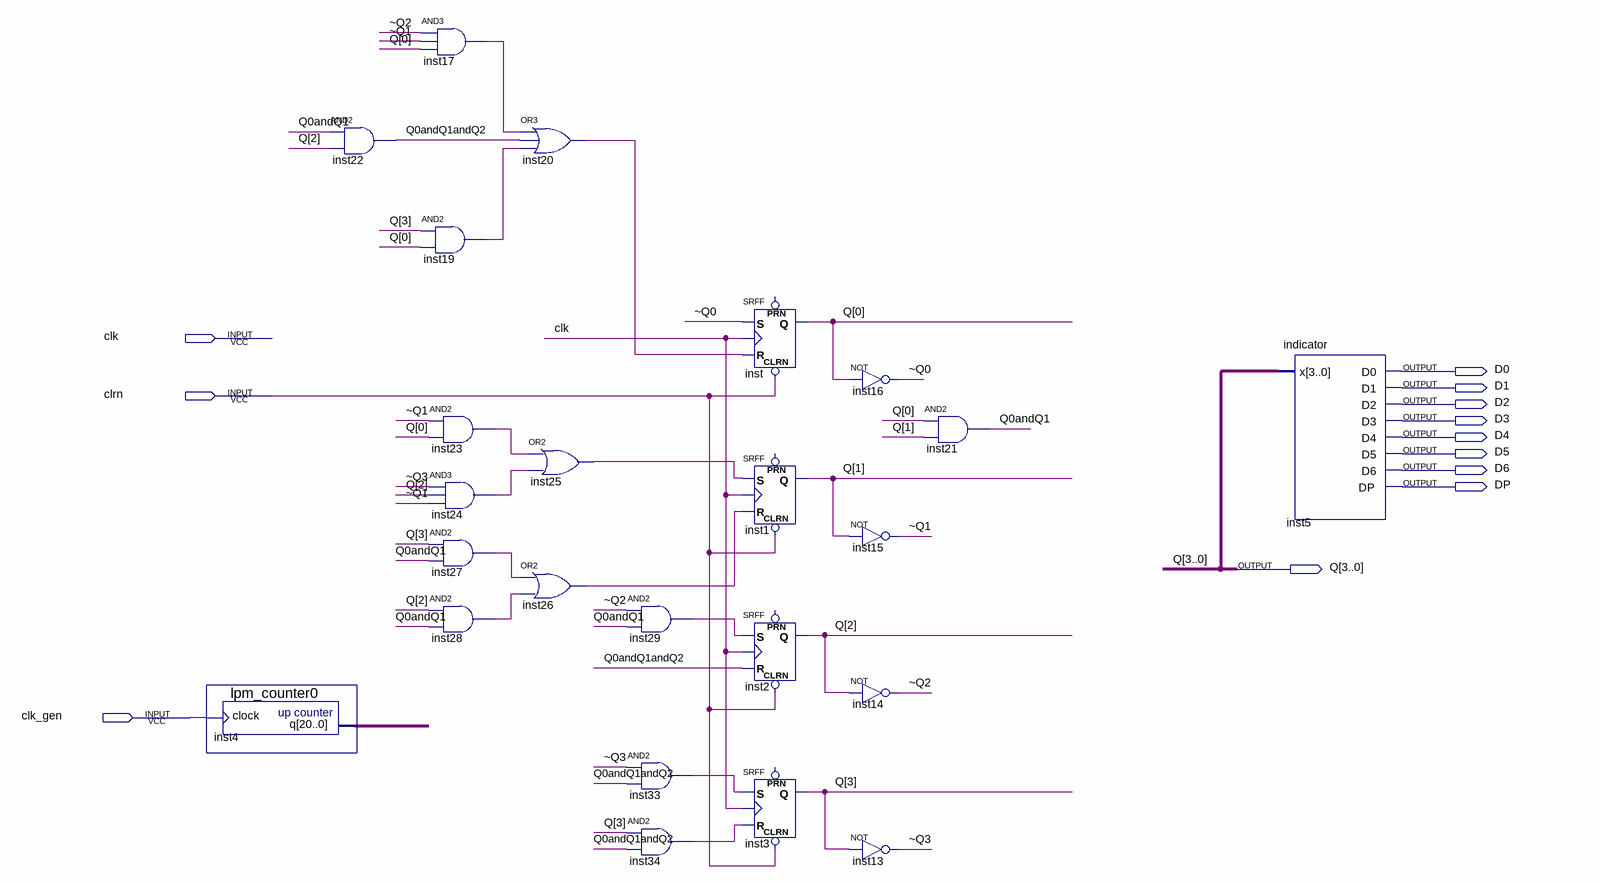
[diagram p0: schematic sheet]
// Quartus schematic lab7p2.bdf as structural Verilog: 24 symbols, 12 pins
module lab7p2 (
  input  clk,
  input  clrn,
  input  clk_gen,
  output D0,
  output D1,
  output D2,
  output D3,
  output D4,
  output D5,
  output D6,
  output DP,
  output [3:0] Q
);

  wire inst17_out, inst19_out, inst20_out, inst23_out, inst24_out, inst25_out, inst26_out, inst27_out,
       inst28_out, inst29_out, inst33_out, inst34_out, Q0andQ1, Q0andQ1andQ2, \~Q0 , \~Q1 , \~Q2 , \~Q3 ;
  wire [20:0] inst4_q;

  lpm_counter0 inst4 (.clock(clk_gen), .q(inst4_q));
  and inst22 (Q0andQ1andQ2, Q0andQ1, Q[2]);
  and inst17 (inst17_out, \~Q2 , \~Q1 , Q[0]);
  and inst19 (inst19_out, Q[3], Q[0]);
  and inst23 (inst23_out, \~Q1 , Q[0]);
  and inst24 (inst24_out, \~Q3 , Q[2], \~Q1 );
  and inst27 (inst27_out, Q[3], Q0andQ1);
  and inst28 (inst28_out, Q[2], Q0andQ1);
  or inst20 (inst20_out, inst17_out, Q0andQ1andQ2, inst19_out);
  or inst25 (inst25_out, inst23_out, inst24_out);
  or inst26 (inst26_out, inst27_out, inst28_out);
  and inst29 (inst29_out, \~Q2 , Q0andQ1);
  and inst33 (inst33_out, \~Q3 , Q0andQ1andQ2);
  and inst34 (inst34_out, Q[3], Q0andQ1andQ2);
  SRFF inst (.CLRN(clrn), .S(\~Q0 ), .R(inst20_out), .CLK(clk), .Q(Q[0]));  // open: PRN
  SRFF inst1 (.CLRN(clrn), .S(inst25_out), .R(inst26_out), .CLK(clk), .Q(Q[1]));  // open: PRN
  SRFF inst2 (.CLRN(clrn), .S(inst29_out), .R(Q0andQ1andQ2), .CLK(clk), .Q(Q[2]));  // open: PRN
  SRFF inst3 (.CLRN(clrn), .S(inst33_out), .R(inst34_out), .CLK(clk), .Q(Q[3]));  // open: PRN
  not inst16 (\~Q0 , Q[0]);
  not inst15 (\~Q1 , Q[1]);
  not inst14 (\~Q2 , Q[2]);
  not inst13 (\~Q3 , Q[3]);
  and inst21 (Q0andQ1, Q[0], Q[1]);
  indicator inst5 (.x(Q), .D0(D0), .D1(D1), .D2(D2), .D3(D3), .D4(D4), .D5(D5), .D6(D6), .DP(DP));
endmodule
